# EAGLE design SWD-Adapter (EAGLE 9.6.2)
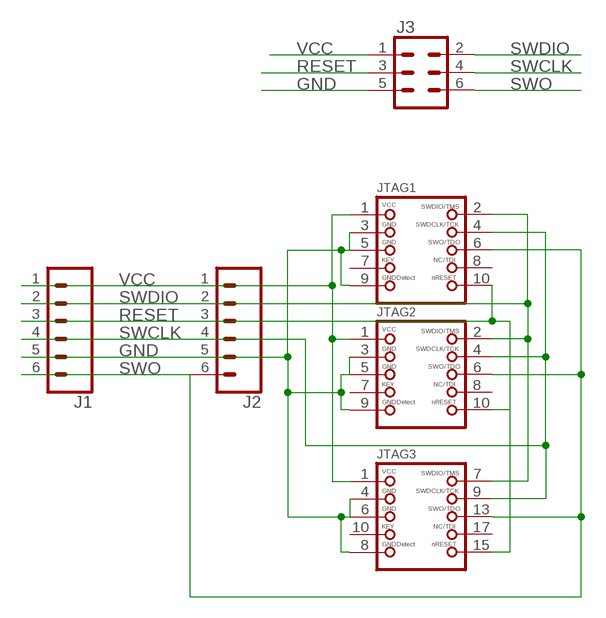
[diagram p0: schematic, sheet 1]

## Parts
J1  CONN_06SILK_FEMALE_PTH  [1X06]
J2  CONN_06SILK_FEMALE_PTH  [1X06]
J3  CONN_03X2NO_SILK  [2X3-NS]
JTAG1  JTAG-CORTEXM3  [2X05_1.27MM_SMT]
JTAG2  JTAG-CORTEXM3MOLEX  [CORTEXM3_SWD10_MOLEX]
JTAG3  JTAG-CORTEXM3MOLEX20  [JTAG-ARM]

## Nets
GND: J1.5 J2.5 J3.5 JTAG1.3 JTAG1.5 JTAG1.9 JTAG2.3 JTAG2.5 JTAG2.9 JTAG3.4 JTAG3.6 JTAG3.8
RESET: J1.3 J2.3 J3.3 JTAG1.10 JTAG2.10 JTAG3.15
SWCLK: J1.4 J2.4 J3.4 JTAG1.4 JTAG2.4 JTAG3.9
SWDIO: J1.2 J2.2 J3.2 JTAG1.2 JTAG2.2 JTAG3.7
SWO: J1.6 J2.6 J3.6 JTAG1.6 JTAG2.6 JTAG3.13
VCC: J1.1 J2.1 J3.1 JTAG1.1 JTAG2.1 JTAG3.1
Unconnected: JTAG1.7 JTAG1.8 JTAG2.7 JTAG2.8 JTAG3.10 JTAG3.17

## Library data of the parts
J1 J2 = SparkFun-Connectors:CONN_06: Multi connection point. Often used as Generic Header-pin footprint for 0.1 inch spaced/style header connections On any of the 0.1 inch spaced packages, you can populate with these: Break Away Headers - Straight <https://www.sparkfun.com/products/116> (PRT-00116) Break Away Male Headers - Right Angle <https://www.sparkfun.com/products/553> (PRT-00553) Female Headers <https://www.sparkfun.com/products/115> (PRT-00115) Break Away Headers - Machine Pin <https://www.sparkfun.com/products/117> (PRT-00117) Break Away Female Headers - Swiss Machine Pin <https://www.sparkfun.com/products/743> (PRT-00743) Arduino Stackable Header - 6 Pin <https://www.sparkfun.com/products/9280> (PRT-09280) For SCREWTERMINALS and SPRING TERMINALS visit here: Screw Terimnals on SparkFun.com <https://www.sparkfun.com/search/results?term=Screw+Terminals> (5mm/3.5mm/2.54mm spacing) This device is also useful as a general connection point to wire up your design to another part of your project. Our various solder wires solder well into these plated through hole pads. Hook-Up Wire - Assortment (Stranded, 22 AWG) <https://www.sparkfun.com/products/11375> (PRT-11375) Hook-Up Wire - Assortment (Solid Core, 22 AWG) <https://www.sparkfun.com/products/11367> (PRT-11367) View the entire wire category on our website here <https://www.sparkfun.com/categories/141>; PROD_ID: CONN-08437
J3 = SparkFun-Connectors:CONN_03X2: Multi connection point. Often used as Generic Header-pin footprint for 0.1 inch spaced/style header connections You can populate with any combo of single row headers, but if you'd like an exact match, check these: Header - 2x3 (Male, 0.1") <https://www.sparkfun.com/products/12807> (PRT-12807) Header - 2x3 (Female, 0.1") <https://www.sparkfun.com/products/13010> (PRT-13010) 2x3 Pin Shrouded Header <https://www.sparkfun.com/products/10877> (PRT-10877) On any of the 0.1 inch spaced packages, you can populate with these: Break Away Headers - Straight <https://www.sparkfun.com/products/116> (PRT-00116) Break Away Male Headers - Right Angle <https://www.sparkfun.com/products/553> (PRT-00553) Female Headers <https://www.sparkfun.com/products/115> (PRT-00115) Break Away Headers - Machine Pin <https://www.sparkfun.com/products/117> (PRT-00117) Break Away Female Headers - Swiss Machine Pin <https://www.sparkfun.com/products/743> (PRT-00743) Special note: the shrouded connector mates well with our 3x2 ribbon cables: Ribbon Crimp Connector - 6-pin (2x3, Female) <https://www.sparkfun.com/products/10651> (PRT-10651) Ribbon Cable - 6 wire (15ft) <https://www.sparkfun.com/products/10646> (PRT-10646)
JTAG1-JTAG3 = microbuilder:JTAG-CORTEXM3: Serial Wire (SW-DP) Connector This standard 0.05" 10-pin connector is for use with the Cortex M0/M3's native SWD (serial wire debugger) interface (SW-DP). Some boards support a 20-pin combined JTAG+SWD connector (SWJ-DP), such as the LPC1700 family, but many smaller devices only work with SWD which typically use the smaller 10-pin SW-DP connecter (the LPC1300 family, for example, only supports SWD). 2x05 1.27mm/0.05" Connector: This is the standard SMT connector defined by ARM for all Cortex devices, and should be used in most situations and for forward-compatibility since any new devices coming to market will likely use this connector. MOLEX 10 Pin 0.1" Connector: This 0.1" 10 pin connector has the same pin layout as the standard 0.05" connector, but is easier to work with if you are using standard jumper wires or custom cables to connect your SWD hardware. MOLEX 20 Pin 0.1" Connector: This 0.1" 20 pin connector is the same model used for ARM7/ARM9 JTAG debuggers, but is connected to match the pins on the Segger J-Link for ARM (which supports both JTAG and SWD debugging). See the following document from ARM for more information on Cortex M3 Debug Connectors: http://infocenter.arm.com/help/topic/com.arm.doc.faqs/attached/13634/cortex_debug_connectors.pdf And the following page for an overview with images of the different connector types: http://www.keil.com/peripherals/coresight/connectors.asp

## Board
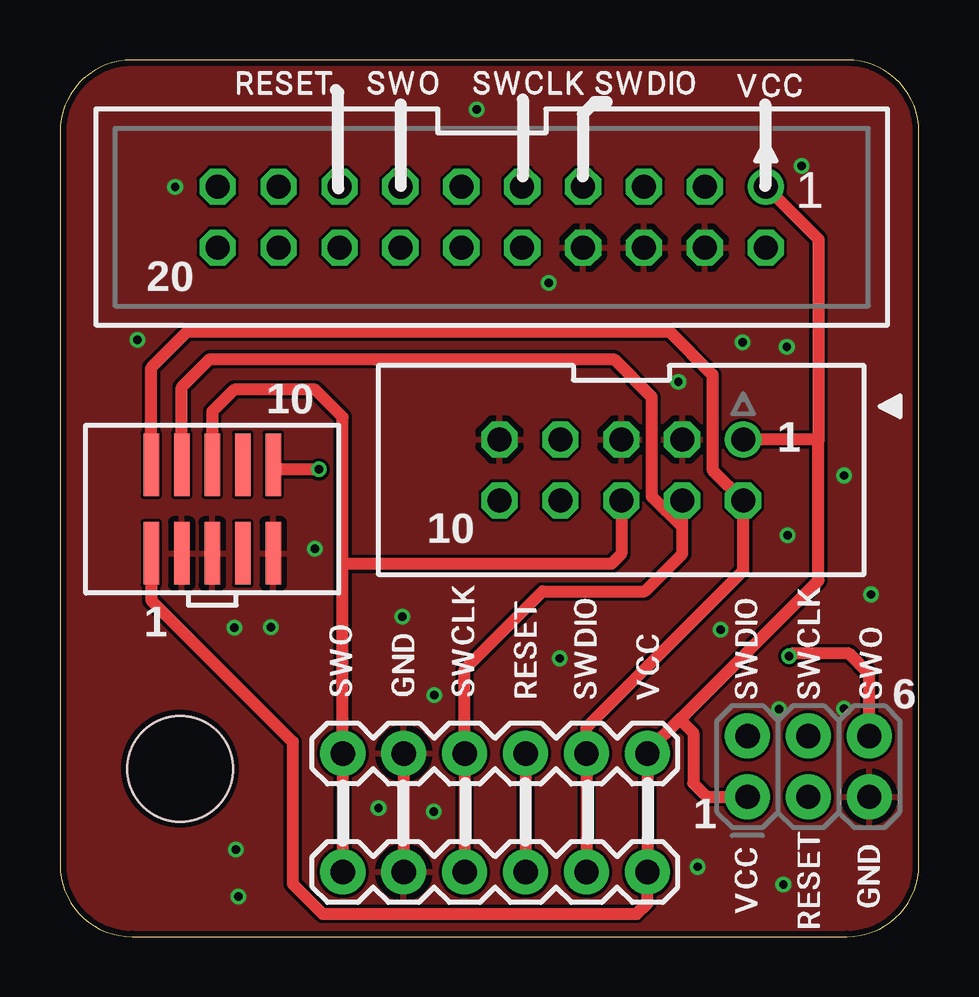
[diagram p1: board, top side]
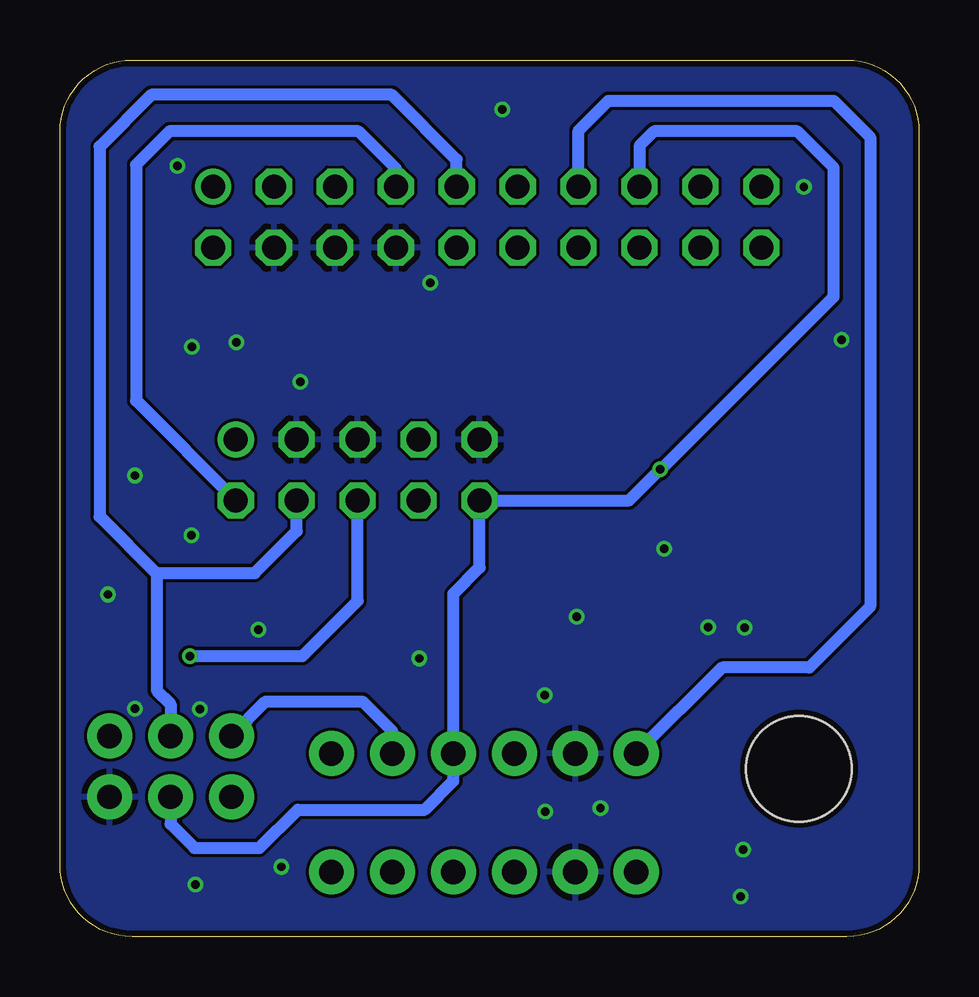
[diagram p2: board, bottom side, seen from below]

Size 35.81 x 36.55 mm. Coordinates in mm from the lower left corner, seen from the top.
Outline: 0,33.55 0,3 arc90 3,0 32.81,0 arc90 35.81,3 35.81,33.55 arc90 32.81,36.55 3,36.55 arc90 0,33.55
Copper layers (1*16): Top 0.035mm / dielectric 0.8mm / Bottom 0.035mm
Design rules "jlc-2layer": minimum track width 6mil, minimum drill 0.3mm, track to track 5mil, track to pad 5mil, pad to pad 5mil, via to via 5mil, smd to smd 0mil, copper to edge 0.25mm, drill to drill 10mil, minimum pad ring 10mil, minimum via ring 0.15mm, stop-mask expansion 2mil, vias tented up to drill 100mil, thermal gap 10mil
Holes 4.4 mm at 5,7

### Footprints (pad centres in the part's own frame; a part is rotated, then mirrored left to right if it is on the bottom)
1X06 = drill 1.016 pad 1.88: 1 0,0; 2 2.54,0; 3 5.08,0; 4 7.62,0; 5 10.16,0; 6 12.7,0
2X3-NS = drill 1.016 pad 1.88: 1 -2.54,-1.27; 2 -2.54,1.27; 3 0,-1.27; 4 0,1.27; 5 2.54,-1.27; 6 2.54,1.27
2X05_1.27MM_SMT = smd 0.65 x 2.6: 1 -2.54,-1.85; 2 -2.54,1.85; 3 -1.27,-1.85; 4 -1.27,1.85; 5 0,-1.85; 6 0,1.85; 7 1.27,-1.85; 8 1.27,1.85; 9 2.54,-1.85; 10 2.54,1.85
CORTEXM3_SWD10_MOLEX = drill 1: 1 -5.08,-1.27 | drill 1 octagon: 2 -5.08,1.27; 3 -2.54,-1.27; 4 -2.54,1.27; 5 0,-1.27; 6 0,1.27; 7 2.54,-1.27; 8 2.54,1.27; 9 5.08,-1.27; 10 5.08,1.27
JTAG-ARM = drill 1: 1 -11.43,-1.27 | drill 1 octagon: 2 -11.43,1.27; 3 -8.89,-1.27; 4 -8.89,1.27; 5 -6.35,-1.27; 6 -6.35,1.27; 7 -3.81,-1.27; 8 -3.81,1.27; 9 -1.27,-1.27; 10 -1.27,1.27; 11 1.27,-1.27; 12 1.27,1.27; 13 3.81,-1.27; 14 3.81,1.27; 15 6.35,-1.27; 16 6.35,1.27; 17 8.89,-1.27; 18 8.89,1.27; 19 11.43,-1.27; 20 11.43,1.27

### Placement (x,y rotation side)
J1  24.49,2.7 180 top
J2  24.49,7.64 180 top
J3  31.2,7.1 0 top
JTAG1  6.35,17.83 0 top
JTAG2  23.4,19.46 180 top
JTAG3  18,30 180 top
U$1  [SWO0]  11.7,9.3 90 top
U$2  [GND0]  14.3,9.3 90 top
U$3  [SWCLK0]  16.8,9.3 90 top
U$4  [RESET0]  19.4,9.2 90 top
U$5  [SWDIO0]  21.9,9.2 90 top
U$6  [VCC0]  24.5,9.2 90 top
U$7  [SWO0]  12.1,35.6 0 top
U$8  [SWDIO0]  21.6,35.6 0 top
U$9  [RESET0]  6.6,35.6 0 top
U$10  [VCC0]  27.54,35.49 0 top
U$11  [SWCLK0]  16.5,35.6 0 top
U$12  [SWO0]  33.8,9.2 90 top
U$13  [RESET0]  31.2,-0.4 90 top
U$14  [VCC0]  28.6,0.3 90 top
U$15  [GND0]  33.7,0.5 90 top
U$16  [SWCLK0]  31.2,9.2 90 top
U$17  [SWDIO0]  28.6,9.2 90 top

### Tracks (layer width: path | path; a pad name or v marks a point on that pad's centre or on a via)
GND  (via drill 0.35)
  Top 0.508: J2.5 J1.5
  other vias: 25.78,23.14 14.27,13.33 8.79,12.9 10.62,16.18 3.23,24.89 20.37,27.25 17.37,34.49 4.8,31.27 30.91,32.13 30.3,24.59 29.98,9.49 33.81,14.27 32.69,19.23 30.33,16.74 27.54,12.79 20.83,11.6 15.6,10.08 7.33,3.63 13.28,5.37 30.16,2.17 26.59,2.92 7.44,1.68 28.45,24.77 7.26,12.88 32.69,9.52 15.59,5.22
  pour Top: -1.78,40.31 -1.78,-2.72 38.1,-2.72 38.1,38.61 38.02,38.61 38.02,40.31
  pour Bottom: -3.66,41.68 -3.66,-5.26 40.08,-5.26 40.08,41.68
RESET  (via drill 0.35)
  Top 0.508: v10.79,19.48 9.09,19.48 JTAG1.10 | J2.3 J1.3
  Bottom 0.508: JTAG3.15 11.65,32.98 11.05,33.58 5.08,33.58 3.56,32.05 3.56,26.68 10.76,19.48 v10.79,19.48 12.09,18.19 JTAG2.10 18.32,15.38 19.41,14.3 J2.3 19.41,6.49 20.6,5.3 25.9,5.3 27.5,3.7 30.2,3.7 31.2,4.7 J3.3
SWCLK
  Top 0.508: 25.94,17.09 25.94,15.96 24.38,14.4 20.12,14.4 16.87,11.15 J2.4 J1.4 | 25.94,17.09 JTAG2.4 | JTAG1.4 5.08,22.91 6.25,24.08 23.09,24.08 24.66,22.5 24.66,18.37 25.94,17.09
  Bottom 0.508: JTAG3.9 19.27,32.4 21.97,35.1 32,35.1 34.16,32.94 34.16,17.51 31.78,15.12 | JTAG2.4 25.94,16.91 27.69,15.16 31.74,15.16 31.78,15.12 | 31.78,15.12 31.78,10.28 31.2,9.7 J3.4
SWDIO
  Top 0.508: JTAG1.2 3.81,23.72 5.31,25.22 25.4,25.22 27.2,23.42 27.2,19.47 JTAG2.2 28.48,15.27 21.95,8.73 J2.2 J1.2
  Bottom 0.508: JTAG3.7 21.81,32.02 23.37,33.58 31.24,33.58 32.64,32.18 32.64,22.35 JTAG2.2 | J3.2 27.23,9.8 23.2,9.8 21.95,8.55 J2.2
SWO  (via drill 0.35)
  Top 0.508: 11.79,15.54 J2.6 J1.6 | 11.79,15.54 11.79,21.66 10.64,22.81 7.26,22.81 6.35,21.89 JTAG1.6 | JTAG2.6 23.4,15.96 22.99,15.54 11.79,15.54 | J3.6 33.74,10.96 32.9,11.8 30.5,11.8 v30.4,11.7
  Bottom 0.508: JTAG3.13 14.19,33.61 12.95,34.85 3.56,34.85 2.03,33.32 2.03,13.77 4.57,11.23 8.2,11.23 J2.6 | v30.4,11.7 25.7,11.7 23.4,14 JTAG2.6
VCC
  Top 0.508: JTAG1.1 3.81,14.02 9.7,8.13 9.7,2.21 10.96,0.95 24.04,0.95 24.49,1.4 J1.1 J2.1 24.49,7.72 25.83,9.07 | 31.62,20.68 31.62,14.85 25.83,9.07 | 31.62,20.68 31.58,20.73 JTAG2.1 | JTAG3.1 31.62,29.08 31.62,20.68 | 25.83,9.07 26.4,8.5 26.4,6.4 26.97,5.83 J3.1

### Text on the board
tPlace: 20 | 10 | 1 | 10 | 1 | 6 | 1